# EAGLE schematic Schematico_prova_3a 1 (EAGLE 9.6.2)
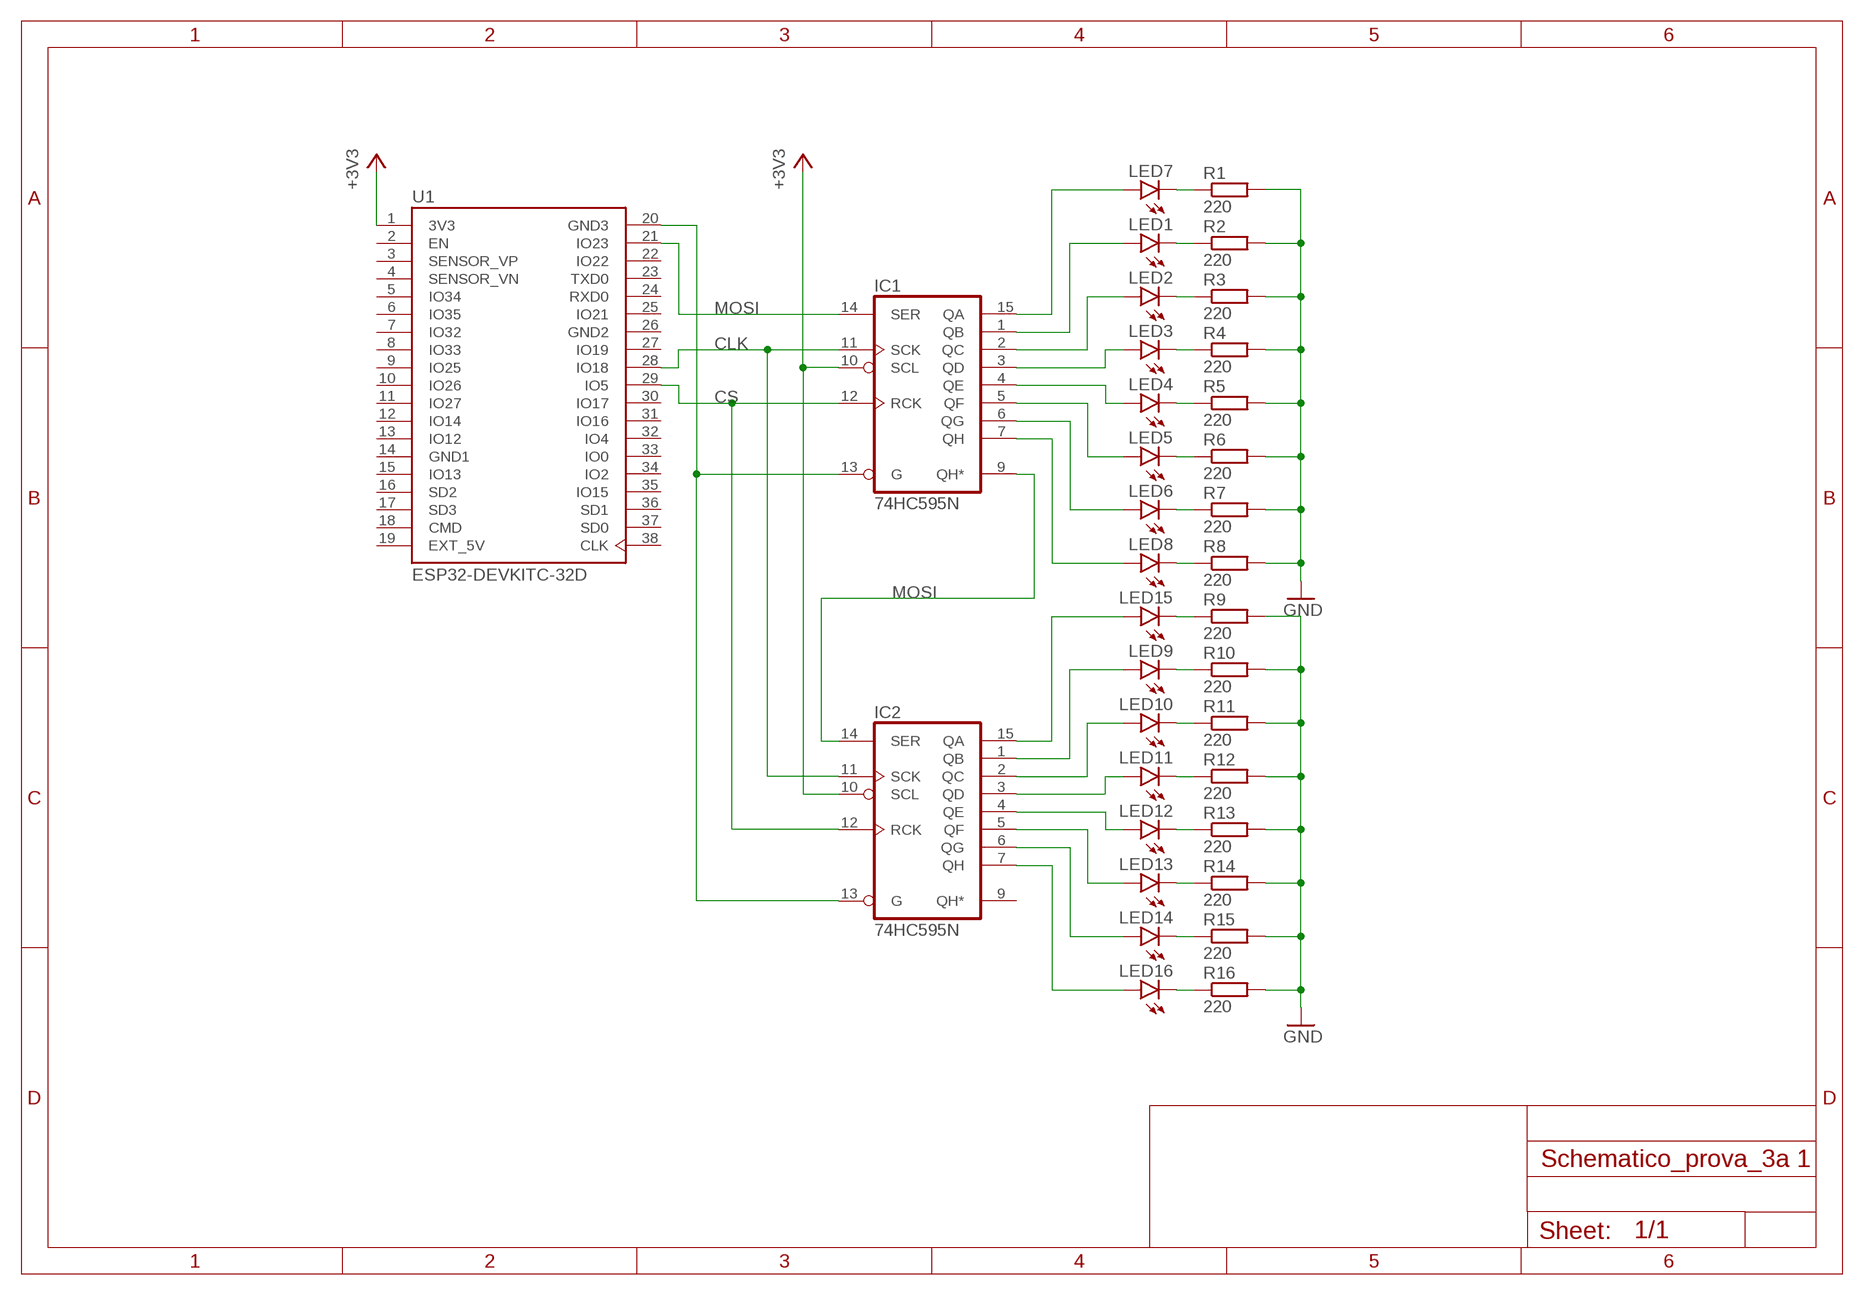
[diagram p0: schematic, sheet 1]

## Parts
IC1  74HC595N  [DIL16]
IC2  74HC595N  [DIL16]
LED1  LED  [SMARTLED-TTW]
LED2  LED  [SMARTLED-TTW]
LED3  LED  [SMARTLED-TTW]
LED4  LED  [SMARTLED-TTW]
LED5  LED  [SMARTLED-TTW]
LED6  LED  [SMARTLED-TTW]
LED7  LED  [SMARTLED-TTW]
LED8  LED  [SMARTLED-TTW]
LED9  LED  [SMARTLED-TTW]
LED10  LED  [SMARTLED-TTW]
LED11  LED  [SMARTLED-TTW]
LED12  LED  [SMARTLED-TTW]
LED13  LED  [SMARTLED-TTW]
LED14  LED  [SMARTLED-TTW]
LED15  LED  [SMARTLED-TTW]
LED16  LED  [SMARTLED-TTW]
R1  220  R-EU_M1406  [M1406]
R2  220  R-EU_M1406  [M1406]
R3  220  R-EU_M1406  [M1406]
R4  220  R-EU_M1406  [M1406]
R5  220  R-EU_M1406  [M1406]
R6  220  R-EU_M1406  [M1406]
R7  220  R-EU_M1406  [M1406]
R8  220  R-EU_M1406  [M1406]
R9  220  R-EU_M1406  [M1406]
R10  220  R-EU_M1406  [M1406]
R11  220  R-EU_M1406  [M1406]
R12  220  R-EU_M1406  [M1406]
R13  220  R-EU_M1406  [M1406]
R14  220  R-EU_M1406  [M1406]
R15  220  R-EU_M1406  [M1406]
R16  220  R-EU_M1406  [M1406]
U1  ESP32-DEVKITC-32D  [MODULE_ESP32-DEVKITC-32D]

## Nets
+3V3: IC1.10(SCL) IC2.10(SCL) U1.1(3V3)
CLK: IC1.11(SCK) IC2.11(SCK) U1.28(IO18)
CS: IC1.12(RCK) IC2.12(RCK) U1.29(IO5)
GND: R1.2 R2.2 R3.2 R4.2 R5.2 R6.2 R7.2 R8.2 R9.2 R10.2 R11.2 R12.2 R13.2 R14.2 R15.2 R16.2
MOSI: IC1.9(QH*) IC1.14(SER) IC2.14(SER) U1.21(IO23)
N$2: IC1.13(G) IC2.13(G) U1.20(GND3)
N$4: IC1.3(QD) LED3.A@1(A)
N$5: IC1.4(QE) LED4.A@1(A)
N$6: IC1.5(QF) LED5.A@1(A)
N$7: LED7.C@1(C) R1.1
N$8: IC1.6(QG) LED6.A@1(A)
N$9: IC1.7(QH) LED8.A@1(A)
N$10: IC1.2(QC) LED2.A@1(A)
N$11: IC1.1(QB) LED1.A@1(A)
N$13: LED1.C@1(C) R2.1
N$14: LED2.C@1(C) R3.1
N$15: LED3.C@1(C) R4.1
N$16: LED4.C@1(C) R5.1
N$17: LED5.C@1(C) R6.1
N$18: LED6.C@1(C) R7.1
N$19: LED8.C@1(C) R8.1
N$20: IC1.15(QA) LED7.A@1(A)
N$21: LED15.C@1(C) R9.1
N$22: LED9.C@1(C) R10.1
N$23: LED10.C@1(C) R11.1
N$24: LED11.C@1(C) R12.1
N$25: LED12.C@1(C) R13.1
N$26: LED13.C@1(C) R14.1
N$27: LED14.C@1(C) R15.1
N$28: LED16.C@1(C) R16.1
N$29: IC2.4(QE) LED12.A@1(A)
N$30: IC2.3(QD) LED11.A@1(A)
N$31: IC2.5(QF) LED13.A@1(A)
N$32: IC2.6(QG) LED14.A@1(A)
N$33: IC2.7(QH) LED16.A@1(A)
N$34: IC2.2(QC) LED10.A@1(A)
N$35: IC2.1(QB) LED9.A@1(A)
N$36: IC2.15(QA) LED15.A@1(A)
Unconnected: IC2.9(QH*) U1.2(EN) U1.3(SENSOR_VP) U1.4(SENSOR_VN) U1.5(IO34) U1.6(IO35) U1.7(IO32) U1.8(IO33) U1.9(IO25) U1.10(IO26) U1.11(IO27) U1.12(IO14) U1.13(IO12) U1.15(IO13) U1.16(SD2) U1.17(SD3) U1.18(CMD) U1.22(IO22) U1.23(TXD0) U1.24(RXD0) U1.25(IO21) U1.27(IO19) U1.30(IO17) U1.31(IO16) U1.32(IO4) U1.33(IO0) U1.34(IO2) U1.35(IO15) U1.36(SD1) U1.37(SD0) U1.38(CLK)

## Power pins joined to a net without a drawn wire
EXT_5V: U1.19(EXT_5V)
GND: IC1.8(GND) IC2.8(GND)
GND1: U1.14(GND1)
GND2: U1.26(GND2)
VCC: IC1.16(VCC) IC2.16(VCC)

## Library data of the parts
IC1 IC2 = 74xx-eu:74*595: 8-bit SHIFT REGISTER, output latch
LED1-LED16 = led_LargePads:LED: LED OSRAM: - CHIPLED LG R971, LG N971, LY N971, LG Q971, LY Q971, LO R971, LY R971 LH N974, LH R974 LS Q976, LO Q976, LY Q976 LO Q996 - Hyper CHIPLED LW Q18S LB Q993, LB Q99A, LB R99A - SideLED LS A670, LO A670, LY A670, LG A670, LP A670 LB A673, LV A673, LT A673, LW A673 LH A674 LY A675 LS A676, LA A676, LO A676, LY A676, LW A676 LS A679, LY A679, LG A679 - Hyper Micro SIDELED® LS Y876, LA Y876, LO Y876, LY Y876 LT Y87S - SmartLED LW L88C, LW L88S LB L89C, LB L89S, LG L890 LS L89K, LO L89K, LY L89K LS L896, LA L896, LO L896, LY L896 - TOPLED LS T670, LO T670, LY T670, LG T670, LP T670 LSG T670, LSP T670, LSY T670, LOP T670, LYG T670 LG T671, LOG T671, LSG T671 LB T673, LV T673, LT T673, LW T673 LH T674 LS T676, LA T676, LO T676, LY T676, LB T676, LH T676, LSB T676, LW T676 LB T67C, LV T67C, LT T67C, LS T67K, LO T67K, LY T67K, LW E67C LS E67B, LA E67B, LO E67B, LY E67B, LB E67C, LV E67C, LT E67C LW T67C LS T679, LY T679, LG T679 LS T770, LO T770, LY T770, LG T770, LP T770 LB T773, LV T773, LT T773, LW T773 LH T774 LS E675, LA E675, LY E675, LS T675 LS T776, LA T776, LO T776, LY T776, LB T776 LHGB T686 LT T68C, LB T68C - Hyper Mini TOPLED® LB M676 - Mini TOPLED Santana® LG M470 LS M47K, LO M47K, LY M47K Source: http://www.osram.convergy.de LUXEON: - LUMILED® LXK2-PW12-R00, LXK2-PW12-S00, LXK2-PW14-U00, LXK2-PW14-V00 LXK2-PM12-R00, LXK2-PM12-S00, LXK2-PM14-U00 LXK2-PE12-Q00, LXK2-PE12-R00, LXK2-PE12-S00, LXK2-PE14-T00, LXK2-PE14-U00 LXK2-PB12-K00, LXK2-PB12-L00, LXK2-PB12-M00, LXK2-PB14-N00, LXK2-PB14-P00, LXK2-PB14-Q00 LXK2-PR12-L00, LXK2-PR12-M00, LXK2-PR14-Q00, LXK2-PR14-R00 LXK2-PD12-Q00, LXK2-PD12-R00, LXK2-PD12-S00 LXK2-PH12-R00, LXK2-PH12-S00 LXK2-PL12-P00, LXK2-PL12-Q00, LXK2-PL12-R00 Source: www.luxeon.com KINGBRIGHT: KA-3528ASYC Source: www.kingbright.com
R1-R16 = rcl_LargePads:R-EU_: RESISTOR, European symbol
U1 = ESP32-DEVKITC-32D:ESP32-DEVKITC-32D: Eval Board For Esp-Wroom-32 Check prices <https://pricing.snapeda.com/parts/ESP32-DEVKITC-32D/Espressif%20Systems/view-part?ref=eda>; AVAILABILITY: Warning; DESCRIPTION: WiFi Development Tools (802.11) ESP32 General Development Kit, ESP32-WROOM-32D on the board; MF: Espressif Systems; MP: ESP32-DEVKITC-32D; PACKAGE: None; PRICE: None; PURCHASE-URL: https://pricing.snapeda.com/search/part/ESP32-DEVKITC-32D/?ref=eda